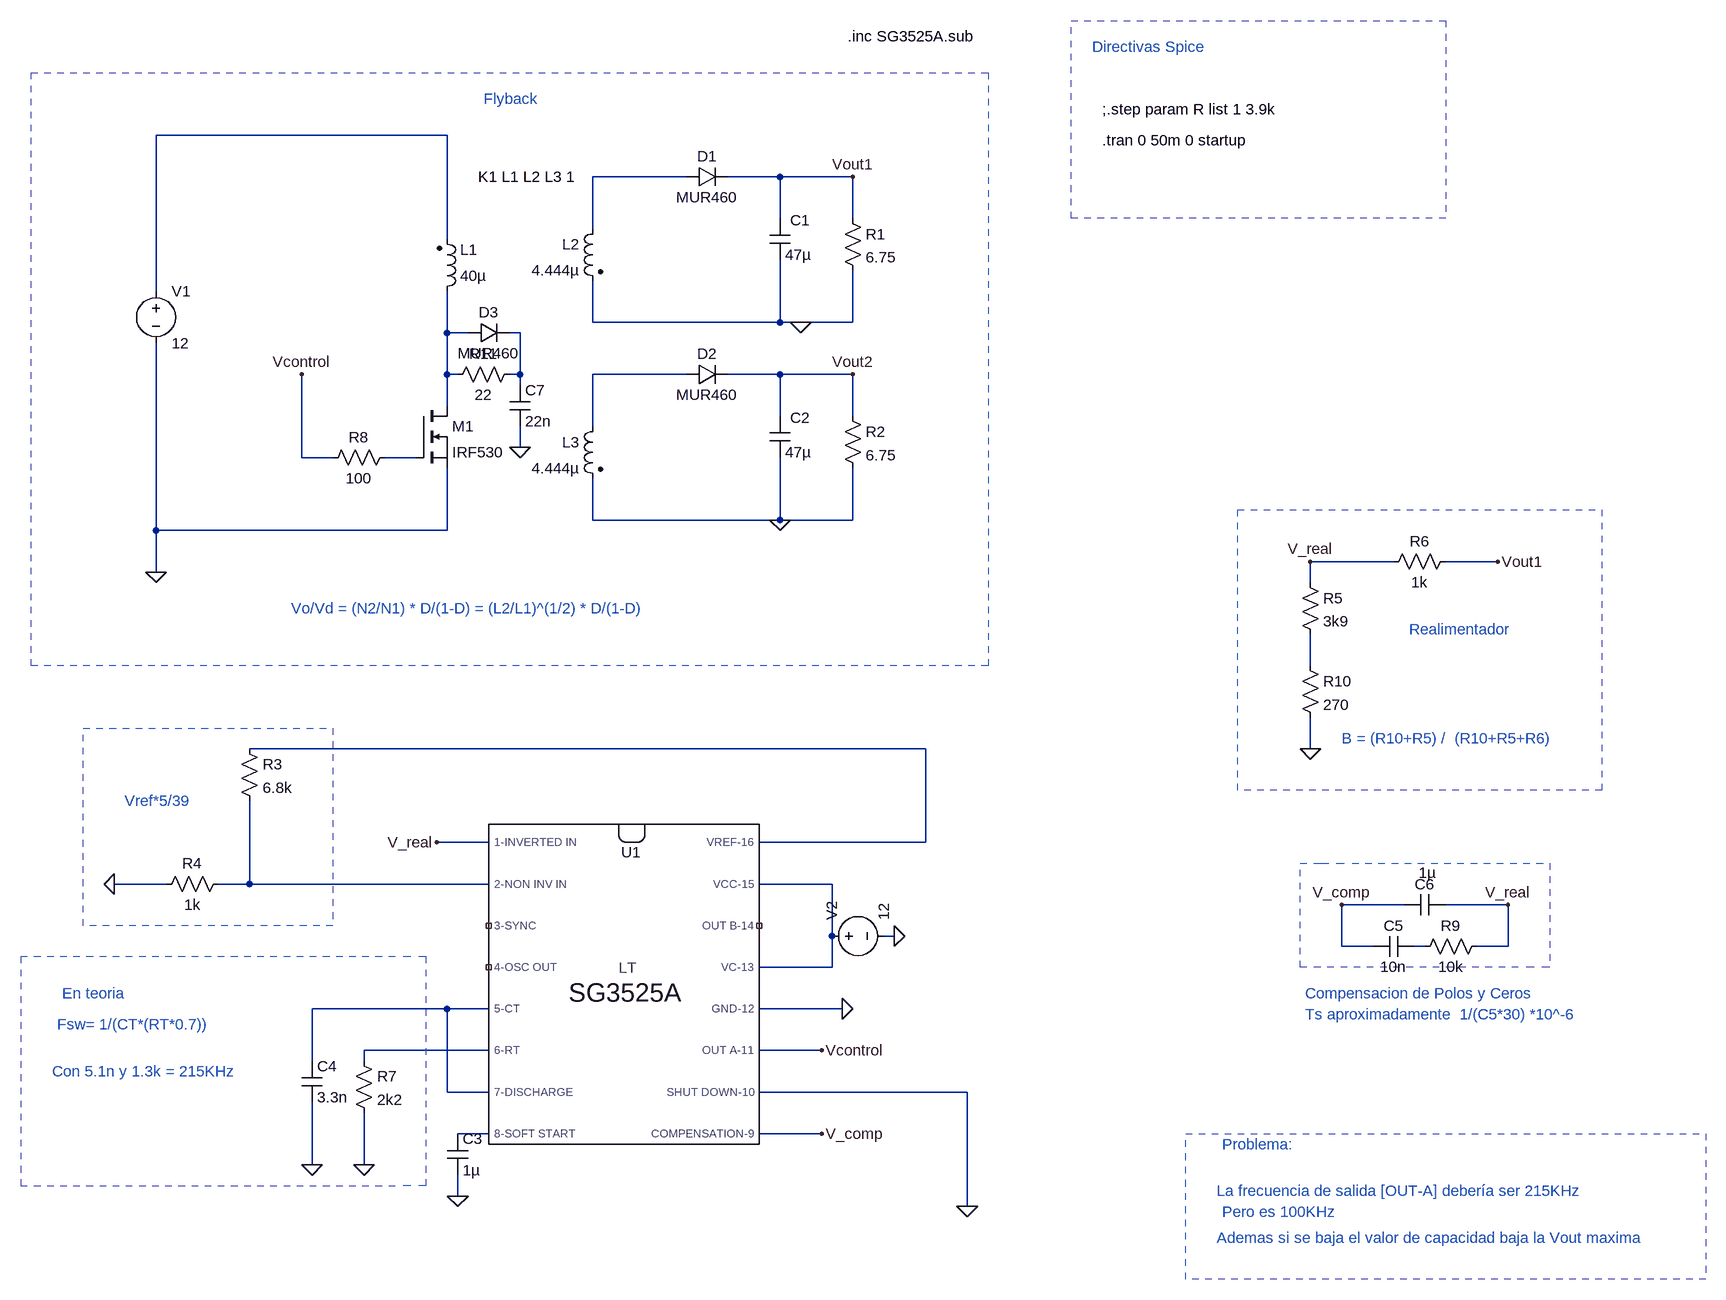
[diagram p0: schematic FlyBack_CL_realimentado_homografica.asc]
FlyBack_CL_realimentado_homografica.asc, the LTspice schematic file:
Version 4
SHEET 1 2728 2080
WIRE 48 -240 -400 -240
WIRE 416 -176 272 -176
WIRE 560 -176 480 -176
WIRE 672 -176 560 -176
WIRE 560 -112 560 -176
WIRE 672 -112 672 -176
WIRE 272 -96 272 -176
WIRE 48 -80 48 -240
WIRE -400 0 -400 -240
WIRE 272 48 272 -16
WIRE 560 48 560 -48
WIRE 560 48 272 48
WIRE 592 48 560 48
WIRE 672 48 672 -32
WIRE 672 48 592 48
WIRE 48 64 48 0
WIRE 80 64 48 64
WIRE 160 64 144 64
WIRE 48 128 48 64
WIRE 64 128 48 128
WIRE 160 128 160 64
WIRE 160 128 144 128
WIRE 416 128 272 128
WIRE 560 128 480 128
WIRE 672 128 560 128
WIRE 160 144 160 128
WIRE 48 176 48 128
WIRE 560 192 560 128
WIRE 672 192 672 128
WIRE 272 208 272 128
WIRE 160 240 160 208
WIRE -176 256 -176 128
WIRE -128 256 -176 256
WIRE 0 256 -48 256
WIRE 272 352 272 288
WIRE 560 352 560 256
WIRE 560 352 272 352
WIRE 672 352 672 272
WIRE 672 352 560 352
WIRE -400 368 -400 80
WIRE 48 368 48 272
WIRE 48 368 -400 368
WIRE 1504 416 1376 416
WIRE 1664 416 1584 416
WIRE -400 432 -400 368
WIRE 1376 448 1376 416
WIRE 1376 576 1376 528
WIRE 784 704 -256 704
WIRE 1376 704 1376 656
WIRE 112 848 32 848
WIRE 784 848 784 704
WIRE 784 848 528 848
WIRE -384 912 -464 912
WIRE -256 912 -256 784
WIRE -256 912 -304 912
WIRE 112 912 -256 912
WIRE 640 912 528 912
WIRE 1520 944 1424 944
WIRE 1680 944 1584 944
WIRE 640 992 640 912
WIRE 736 992 720 992
WIRE 1424 1008 1424 944
WIRE 1472 1008 1424 1008
WIRE 1552 1008 1536 1008
WIRE 1680 1008 1680 944
WIRE 1680 1008 1632 1008
WIRE 640 1040 640 992
WIRE 640 1040 528 1040
WIRE 48 1104 -160 1104
WIRE 112 1104 48 1104
WIRE 656 1104 528 1104
WIRE 112 1168 -80 1168
WIRE 624 1168 528 1168
WIRE -160 1184 -160 1104
WIRE -80 1184 -80 1168
WIRE 48 1232 48 1104
WIRE 112 1232 48 1232
WIRE 848 1232 528 1232
WIRE 112 1296 64 1296
WIRE 624 1296 528 1296
WIRE -160 1344 -160 1248
WIRE -80 1344 -80 1264
WIRE 64 1392 64 1360
WIRE 848 1408 848 1232
FLAG -400 432 0
FLAG 672 -176 Vout1
FLAG 672 128 Vout2
FLAG 656 1104 0
FLAG -464 912 0
FLAG 1376 704 0
FLAG 1664 416 Vout1
FLAG 624 1168 Vcontrol
FLAG 848 1408 0
FLAG 64 1392 0
FLAG -80 1344 0
FLAG -160 1344 0
FLAG 736 992 0
FLAG 32 848 V_real
FLAG 1376 416 V_real
FLAG 1680 944 V_real
FLAG -176 128 Vcontrol
FLAG 592 48 0
FLAG 560 352 0
FLAG 624 1296 V_comp
FLAG 1424 944 V_comp
FLAG 160 240 0
SYMBOL nmos 0 176 R0
SYMATTR InstName M1
SYMATTR Value IRF530
SYMBOL diode 416 -160 R270
WINDOW 0 32 32 VTop 2
WINDOW 3 0 32 VBottom 2
SYMATTR InstName D1
SYMATTR Value MUR460
SYMBOL voltage -400 -16 R0
WINDOW 123 0 0 Left 0
WINDOW 39 0 0 Left 0
SYMATTR InstName V1
SYMATTR Value 12
SYMBOL res -32 240 R90
WINDOW 0 0 56 VBottom 2
WINDOW 3 32 56 VTop 2
SYMATTR InstName R8
SYMATTR Value 100
SYMBOL cap 544 -112 R0
WINDOW 0 32 3 Left 2
SYMATTR InstName C1
SYMATTR Value 47µ
SYMBOL res 656 -128 R0
SYMATTR InstName R1
SYMATTR Value 6.75
SYMBOL ind2 32 16 M180
WINDOW 0 36 80 Left 2
WINDOW 3 36 40 Left 2
SYMATTR InstName L1
SYMATTR Value 40µ
SYMATTR Type ind
SYMBOL ind2 288 -112 M0
SYMATTR InstName L2
SYMATTR Value 4.444µ
SYMATTR Type ind
SYMBOL diode 416 144 R270
WINDOW 0 32 32 VTop 2
WINDOW 3 0 32 VBottom 2
SYMATTR InstName D2
SYMATTR Value MUR460
SYMBOL cap 544 192 R0
WINDOW 0 32 3 Left 2
SYMATTR InstName C2
SYMATTR Value 47µ
SYMBOL res 656 176 R0
SYMATTR InstName R2
SYMATTR Value 6.75
SYMBOL ind2 288 192 M0
SYMATTR InstName L3
SYMATTR Value 4.444µ
SYMATTR Type ind
SYMBOL res -272 688 R0
SYMATTR InstName R3
SYMATTR Value 6.8k
SYMBOL res -288 896 R90
WINDOW 0 0 56 VBottom 2
WINDOW 3 32 56 VTop 2
SYMATTR InstName R4
SYMATTR Value 1k
SYMBOL res 1600 400 R90
WINDOW 0 0 56 VBottom 2
WINDOW 3 32 56 VTop 2
SYMATTR InstName R6
SYMATTR Value 1k
SYMBOL cap 48 1296 R0
SYMATTR InstName C3
SYMATTR Value 1µ
SYMBOL res -96 1168 R0
SYMATTR InstName R7
SYMATTR Value 2k2
SYMBOL cap -176 1184 R0
SYMATTR InstName C4
SYMATTR Value 3.3n
SYMBOL SG3525A 256 944 R0
SYMATTR InstName U1
SYMATTR Value SG3525A
SYMBOL cap 1536 992 R90
WINDOW 0 0 32 VBottom 2
WINDOW 3 32 32 VTop 2
SYMATTR InstName C5
SYMATTR Value 10n
SYMBOL res 1648 992 R90
WINDOW 0 0 56 VBottom 2
WINDOW 3 32 56 VTop 2
SYMATTR InstName R9
SYMATTR Value 10k
SYMBOL cap 1584 928 R90
WINDOW 0 0 32 VBottom 2
WINDOW 3 -49 28 VTop 2
SYMATTR InstName C6
SYMATTR Value 1µ
SYMBOL voltage 624 992 R270
WINDOW 123 0 0 Left 0
WINDOW 39 0 0 Left 0
SYMATTR InstName V2
SYMATTR Value 12
SYMBOL res 1360 560 R0
SYMATTR InstName R10
SYMATTR Value 270
SYMBOL res 1360 432 R0
SYMATTR InstName R5
SYMATTR Value 3k9
SYMBOL diode 80 80 R270
WINDOW 0 32 32 VTop 2
WINDOW 3 0 32 VBottom 2
SYMATTR InstName D3
SYMATTR Value MUR460
SYMBOL cap 144 144 R0
SYMATTR InstName C7
SYMATTR Value 22n
SYMBOL res 160 112 R90
WINDOW 0 0 56 VBottom 2
WINDOW 3 32 56 VTop 2
SYMATTR InstName R11
SYMATTR Value 22
TEXT -192 488 Left 2 ;Vo/Vd = (N2/N1) * D/(1-D) = (L2/L1)^(1/2) * D/(1-D)
TEXT 96 -176 Left 2 !K1 L1 L2 L3 1
TEXT -448 784 Left 2 ;Vref*5/39
TEXT 1056 -232 Left 2 !.tran 0 50m 0 startup
TEXT 664 -392 Left 2 !.inc SG3525A.sub
TEXT 1368 1080 Left 2 ;Compensacion de Polos y Ceros
TEXT 1368 1112 Left 2 ;Ts aproximadamente  1/(C5*30) *10^-6
TEXT 1056 -280 Left 2 !;.step param R list 1 3.9k
TEXT -544 1080 Left 2 ;En teoria
TEXT -552 1128 Left 2 ;Fsw= 1/(CT*(RT*0.7))
TEXT -560 1200 Left 2 ;Con 5.1n y 1.3k = 215KHz
TEXT 1528 520 Left 2 ;Realimentador
TEXT 1424 688 Left 2 ;B = (R10+R5) /  (R10+R5+R6)
TEXT 104 -296 Left 2 ;Flyback
TEXT 1040 -376 Left 2 ;Directivas Spice
TEXT 1232 1384 Left 2 ;La frecuencia de salida [OUT-A] debería ser 215KHz
TEXT 1240 1312 Left 2 ;Problema:
TEXT 1240 1416 Left 2 ;Pero es 100KHz
TEXT 1232 1456 Left 2 ;Ademas si se baja el valor de capacidad baja la Vout maxima
LINE Normal 16 1376 16 1024 2
LINE Normal -608 1376 -32 1376 2
LINE Normal -608 1024 -608 1376 2
LINE Normal -32 1024 -608 1024 2
LINE Normal 1696 1040 1392 1040 2
LINE Normal 1744 880 1744 1040 2
LINE Normal 1440 880 1744 880 2
LINE Normal 1392 880 1440 880 2
LINE Normal 1744 1040 1696 1040 2
LINE Normal 1360 880 1392 880 2
LINE Normal 1360 1040 1360 880 2
LINE Normal 1392 1040 1360 1040 2
LINE Normal 16 1024 -32 1024 2
LINE Normal 16 1376 -32 1376 2
RECTANGLE Normal 1824 768 1264 336 2
RECTANGLE Normal 880 576 -592 -336 2
RECTANGLE Normal -128 976 -512 672 2
RECTANGLE Normal 1584 -112 1008 -416 2
RECTANGLE Normal 1984 1520 1184 1296 2

The netlist it stands for:
* FlyBack_CL_realimentado_homografica.asc
M1 N003 N006 0 0 IRF530
D1 N002 Vout1 MUR460
V1 N001 0 12
R8 N006 Vcontrol 100
C1 Vout1 0 47µ
R1 Vout1 0 6.75
L1 N003 N001 40µ
L2 N002 0 4.444µ
D2 N005 Vout2 MUR460
C2 Vout2 0 47µ
R2 Vout2 0 6.75
L3 N005 0 4.444µ
R3 N008 N009 6.8k
R4 N009 0 1k
R6 Vout1 V_real 1k
C3 N014 0 1µ
R7 N013 0 2k2
C4 N012 0 3.3n
XU1 V_real N009 NC_01 NC_02 N012 N013 N012 N014 V_comp 0 Vcontrol 0 N010 NC_03 N010 N008 SG3525A  ; pins 1-INVERTED_IN 2-NON_INV_IN 3-SYNC 4-OSC_OUT 5-CT 6-RT 7-DISCHARGE 8-SOFT_START COMPENSATION-9 SHUT_DOWN-10 OUT_A-11 GND-12 VC-13 OUT_B-14 VCC-15 VREF-16
C5 N011 V_comp 10n
R9 V_real N011 10k
C6 V_real V_comp 1µ
V2 N010 0 12
R10 N007 0 270
R5 V_real N007 3k9
D3 N003 N004 MUR460
C7 N004 0 22n
R11 N004 N003 22
.model D D
.lib standard.dio
.model NMOS NMOS
.model PMOS PMOS
.lib standard.mos
* Vo/Vd = (N2/N1) * D/(1-D) = (L2/L1)^(1/2) * D/(1-D)
K1 L1 L2 L3 1
* Vref*5/39
.tran 0 50m 0 startup
.inc SG3525A.sub
* Compensacion de Polos y Ceros
* Ts aproximadamente  1/(C5*30) *10^-6
;.step param R list 1 3.9k
* En teoria
* Fsw= 1/(CT*(RT*0.7))
* Con 5.1n y 1.3k = 215KHz
* Realimentador
* B = (R10+R5) /  (R10+R5+R6)
* Flyback
* Directivas Spice
* La frecuencia de salida [OUT-A] debería ser 215KHz
* Problema:
* Pero es 100KHz
* Ademas si se baja el valor de capacidad baja la Vout maxima
.backanno
.end